# EAGLE design Cap Piano - PCB (EAGLE 9.6.2)
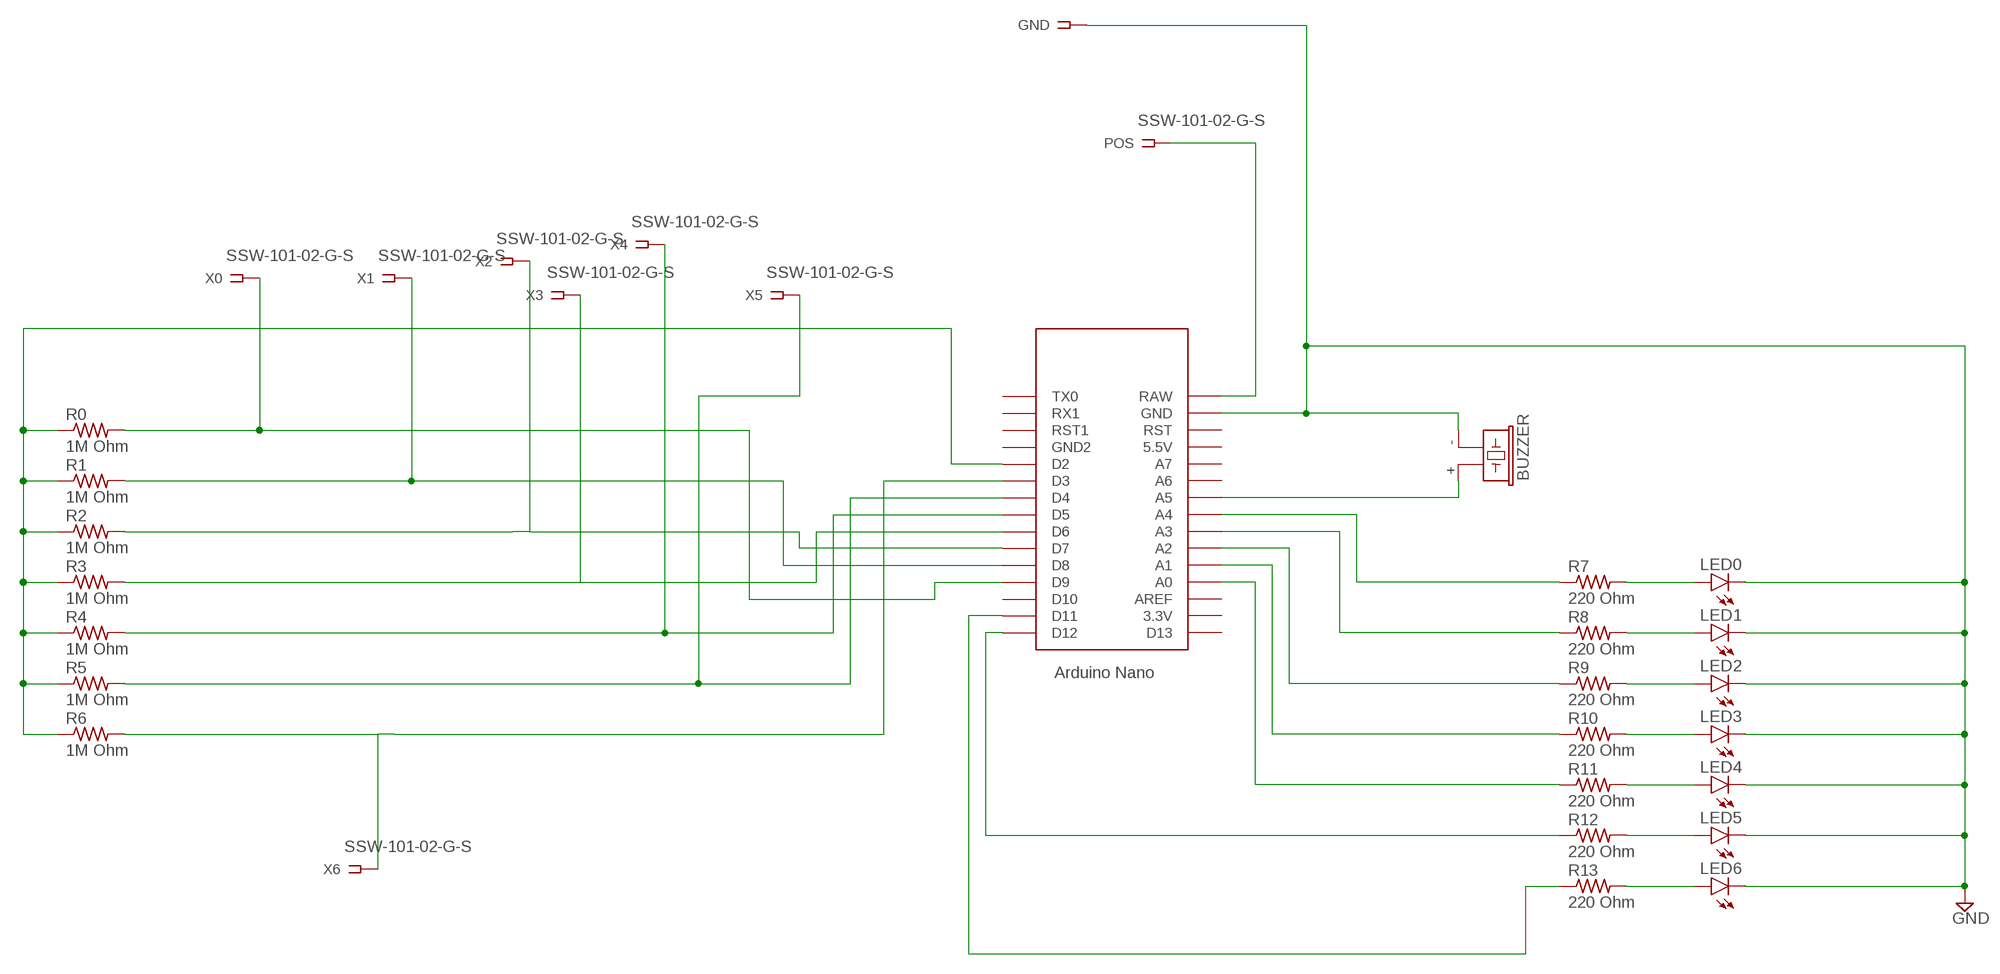
[diagram p0: schematic, sheet 1]

## Parts
BUZZER  F/CM12P  [F/CM12P]
GND  SSW-101-02-G-S  [SSW-101-02-G-S]
LED0  LED5MM  [LED5MM]
LED1  LED5MM  [LED5MM]
LED2  LED5MM  [LED5MM]
LED3  LED5MM  [LED5MM]
LED4  LED5MM  [LED5MM]
LED5  LED5MM  [LED5MM]
LED6  LED5MM  [LED5MM]
POS  SSW-101-02-G-S  [SSW-101-02-G-S]
R0  1M Ohm  R-US_0207/12  [0207/12]
R1  1M Ohm  R-US_0207/12  [0207/12]
R2  1M Ohm  R-US_0207/12  [0207/12]
R3  1M Ohm  R-US_0207/12  [0207/12]
R4  1M Ohm  R-US_0207/12  [0207/12]
R5  1M Ohm  R-US_0207/12  [0207/12]
R6  1M Ohm  R-US_0207/12  [0207/12]
R7  220 Ohm  R-US_0207/12  [0207/12]
R8  220 Ohm  R-US_0207/12  [0207/12]
R9  220 Ohm  R-US_0207/12  [0207/12]
R10  220 Ohm  R-US_0207/12  [0207/12]
R11  220 Ohm  R-US_0207/12  [0207/12]
R12  220 Ohm  R-US_0207/12  [0207/12]
R13  220 Ohm  R-US_0207/12  [0207/12]
U$1  NANO  [NANO]
X0  SSW-101-02-G-S  [SSW-101-02-G-S]
X1  SSW-101-02-G-S  [SSW-101-02-G-S]
X2  SSW-101-02-G-S  [SSW-101-02-G-S]
X3  SSW-101-02-G-S  [SSW-101-02-G-S]
X4  SSW-101-02-G-S  [SSW-101-02-G-S]
X5  SSW-101-02-G-S  [SSW-101-02-G-S]
X6  SSW-101-02-G-S  [SSW-101-02-G-S]

## Nets
GND: BUZZER.- GND.1 LED0.K(C) LED1.K(C) LED2.K(C) LED3.K(C) LED4.K(C) LED5.K(C) LED6.K(C) U$1.GND
N$1: POS.1 U$1.RAW
N$2: R5.2 U$1.D4 X5.1
N$3: BUZZER.+ U$1.A5
N$4: R4.2 U$1.D5 X4.1
N$5: R0.1 R1.1 R2.1 R3.1 R4.1 R5.1 R6.1 U$1.D2
N$6: R6.2 U$1.D3 X6.1
N$9: R3.2 U$1.D6 X3.1
N$10: R2.2 U$1.D7 X2.1
N$11: R1.2 U$1.D8 X1.1
N$12: R0.2 U$1.D9 X0.1
N$14: R13.1 U$1.D11
N$15: R12.1 U$1.D12
N$16: R11.1 U$1.A0
N$17: R10.1 U$1.A1
N$18: R9.1 U$1.A2
N$19: R8.1 U$1.A3
N$20: R7.1 U$1.A4
N$22: LED0.A R7.2
N$23: LED1.A R8.2
N$24: LED2.A R9.2
N$25: LED3.A R10.2
N$26: LED4.A R11.2
N$27: LED5.A R12.2
N$28: LED6.A R13.2
Unconnected: U$1.3.3V U$1.5V(5.5V) U$1.A6 U$1.A7 U$1.AREF U$1.D10 U$1.D13 U$1.GND1(GND2) U$1.ICSP1 U$1.ICSP2 U$1.ICSP3 U$1.ICSP4 U$1.ICSP5 U$1.ICSP6 U$1.RST U$1.RST1 U$1.RX1 U$1.TX0

## Library data of the parts
BUZZER = buzzer:F/CM12P: BUZZER Source: Buerklin; OC_FARNELL: unknown; OC_NEWARK: unknown
GND POS X0 X1-X6 = con-samtec:SSW-101-02-G-S: THROUGH-HOLE .025" SQ POST SOCKET Source: Samtec SSW.pdf; MF: Samtec Inc.; MPN: SSW-101-02-G-S; OC_FARNELL: unknown; OC_NEWARK: 11P9336
LED0 LED1-LED6 = led:LED: LED OSRAM: - CHIPLED LG R971, LG N971, LY N971, LG Q971, LY Q971, LO R971, LY R971 LH N974, LH R974 LS Q976, LO Q976, LY Q976 LO Q996 - Hyper CHIPLED LW Q18S LB Q993, LB Q99A, LB R99A - SideLED LS A670, LO A670, LY A670, LG A670, LP A670 LB A673, LV A673, LT A673, LW A673 LH A674 LY A675 LS A676, LA A676, LO A676, LY A676, LW A676 LS A679, LY A679, LG A679 - Hyper Micro SIDELED® LS Y876, LA Y876, LO Y876, LY Y876 LT Y87S - SmartLED LW L88C, LW L88S LB L89C, LB L89S, LG L890 LS L89K, LO L89K, LY L89K LS L896, LA L896, LO L896, LY L896 - TOPLED LS T670, LO T670, LY T670, LG T670, LP T670 LSG T670, LSP T670, LSY T670, LOP T670, LYG T670 LG T671, LOG T671, LSG T671 LB T673, LV T673, LT T673, LW T673 LH T674 LS T676, LA T676, LO T676, LY T676, LB T676, LH T676, LSB T676, LW T676 LB T67C, LV T67C, LT T67C, LS T67K, LO T67K, LY T67K, LW E67C LS E67B, LA E67B, LO E67B, LY E67B, LB E67C, LV E67C, LT E67C LW T67C LS T679, LY T679, LG T679 LS T770, LO T770, LY T770, LG T770, LP T770 LB T773, LV T773, LT T773, LW T773 LH T774 LS E675, LA E675, LY E675, LS T675 LS T776, LA T776, LO T776, LY T776, LB T776 LHGB T686 LT T68C, LB T68C - Hyper Mini TOPLED® LB M676 - Mini TOPLED Santana® LG M470 LS M47K, LO M47K, LY M47K Source: http://www.osram.convergy.de LUXEON: - LUMILED® LXK2-PW12-R00, LXK2-PW12-S00, LXK2-PW14-U00, LXK2-PW14-V00 LXK2-PM12-R00, LXK2-PM12-S00, LXK2-PM14-U00 LXK2-PE12-Q00, LXK2-PE12-R00, LXK2-PE12-S00, LXK2-PE14-T00, LXK2-PE14-U00 LXK2-PB12-K00, LXK2-PB12-L00, LXK2-PB12-M00, LXK2-PB14-N00, LXK2-PB14-P00, LXK2-PB14-Q00 LXK2-PR12-L00, LXK2-PR12-M00, LXK2-PR14-Q00, LXK2-PR14-R00 LXK2-PD12-Q00, LXK2-PD12-R00, LXK2-PD12-S00 LXK2-PH12-R00, LXK2-PH12-S00 LXK2-PL12-P00, LXK2-PL12-Q00, LXK2-PL12-R00 Source: www.luxeon.com KINGBRIGHT: KA-3528ASYC Source: www.kingbright.com
R0 R1-R13 = rcl:R-US_: RESISTOR, American symbol; SPICEPREFIX: R
U$1 = Arduino-clone:NANO: Arduino Nano

## Board
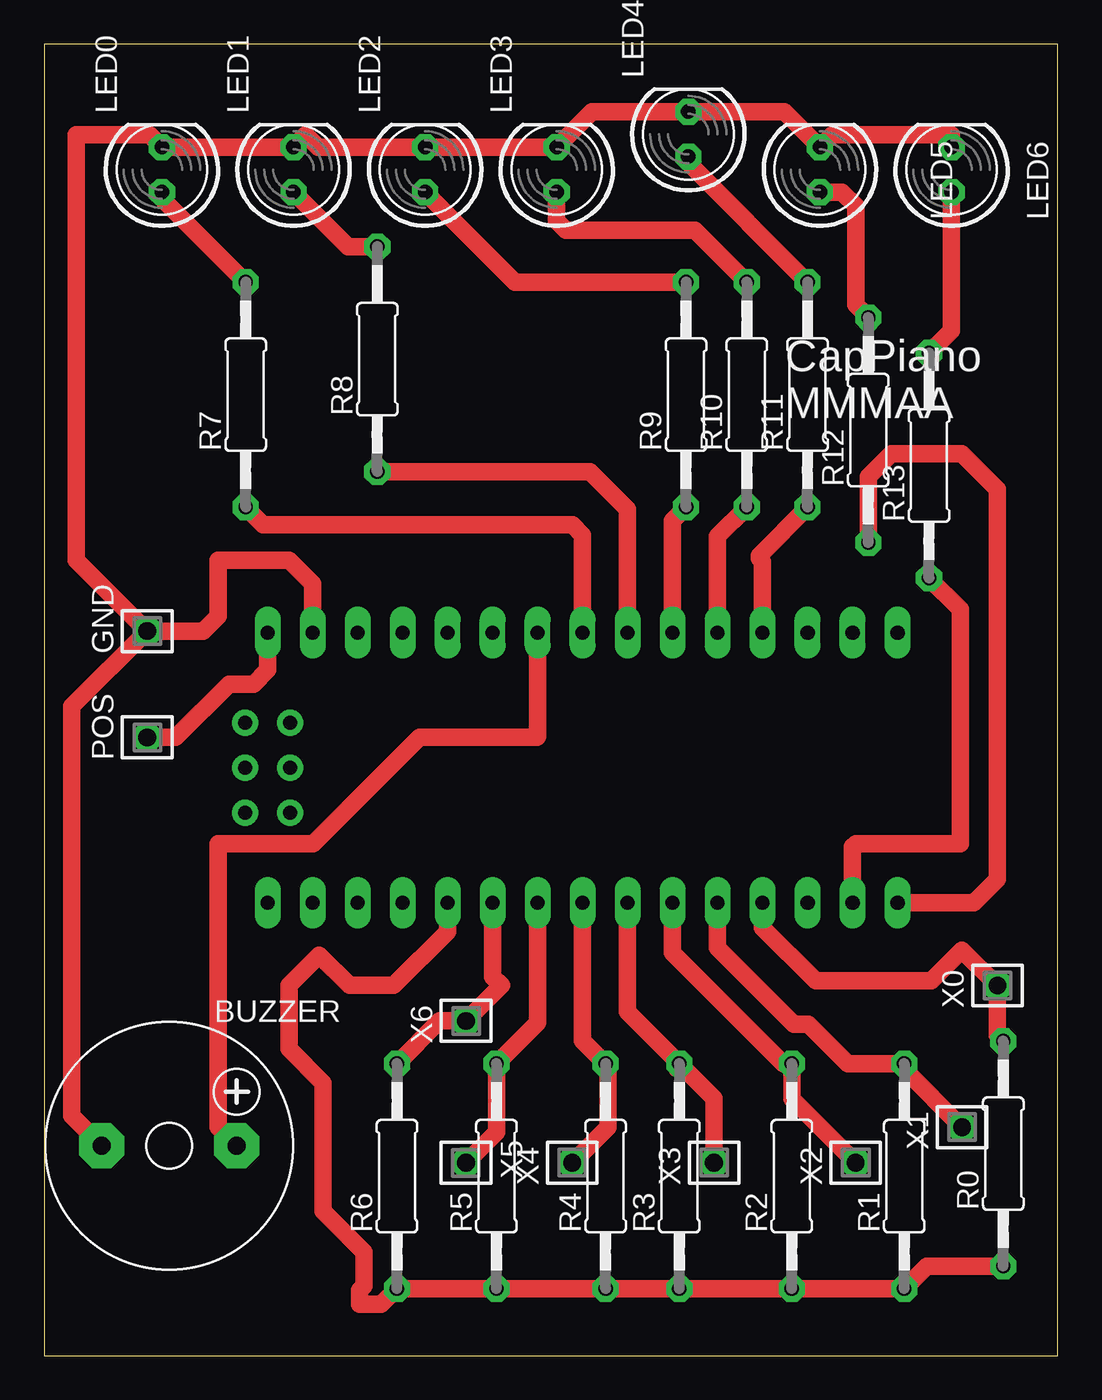
[diagram p1: board, top side]

Size 57.21 x 74 mm. Coordinates in mm from the lower left corner, seen from the top.
Outline: 0,0 57.21,0 57.21,74 0,74 0,0
Copper layers (1*16): Top 0.035mm / dielectric 1.5mm / Bottom 0.035mm
Design rules "default *": minimum track width 1mm, minimum drill 0.35mm, track to track 1mm, track to pad 1mm, pad to pad 1mm, via to via 1mm, smd to smd 1mm, copper to edge 1mm, drill to drill 1mm, minimum pad ring 13mil, minimum via ring 8mil, stop-mask expansion 4mil, vias tented up to drill 0mil, thermal gap 10mil

### Footprints (pad centres in the part's own frame; a part is rotated, then mirrored left to right if it is on the bottom)
F/CM12P = drill 1.016 pad 2.54 octagon: + 3.81,0; - -3.81,0
SSW-101-02-G-S = drill 1 pad 1.5 octagon: 1 0,0
LED5MM = drill 0.813 octagon: A -1.27,0; K 1.27,0
0207/12 = drill 0.813 octagon: 1 -6.35,0; 2 6.35,0
NANO = drill 0.8 long: 3.3V -10.16,24.13; 5V -10.16,-1.27; A0 -10.16,19.05; A1 -10.16,16.51; A2 -10.16,13.97; A3 -10.16,11.43; A4 -10.16,8.89; A5 -10.16,6.35; A6 -10.16,3.81; A7 -10.16,1.27; AREF -10.16,21.59; D2 5.08,1.27; D3 5.08,3.81; D4 5.08,6.35; D5 5.08,8.89; D6 5.08,11.43; D7 5.08,13.97; D8 5.08,16.51; D9 5.08,19.05; D10 5.08,21.59; D11 5.08,24.13; D12 5.08,26.67; D13 -10.16,26.67; GND -10.16,-6.35; GND1 5.08,-1.27; RAW -10.16,-8.89; RST -10.16,-3.81; RST1 5.08,-3.81; RX1 5.08,-6.35; TX0 5.08,-8.89 | drill 0.8: ICSP1 -5.08,-10.16; ICSP2 -5.08,-7.62; ICSP3 -2.54,-10.16; ICSP4 -2.54,-7.62; ICSP5 0,-10.16; ICSP6 0,-7.62

### Placement (x,y rotation side)
BUZZER  7.05,11.85 0 top
GND  5.81,40.89 0 top
LED0  6.64,66.93 90 top
LED1  14.07,66.93 90 top
LED2  21.5,66.93 90 top
LED3  28.93,66.93 90 top
LED4  36.36,68.93 90 top
LED5  43.79,66.93 90 top
LED6  51.22,66.93 90 top
POS  5.81,34.89 0 top
R0  54.14,11.4 90 top
R1  48.55,10.13 90 top
R2  42.2,10.13 90 top
R3  35.85,10.13 90 top
R4  31.69,10.13 90 top
R5  25.53,10.13 90 top
R6  19.91,10.13 90 top
R7  11.37,54.23 90 top
R8  18.8,56.23 90 top
R9  36.23,54.23 90 top
R10  39.66,54.23 90 top
R11  43.09,54.23 90 top
R12  46.52,52.23 90 top
R13  49.95,50.23 90 top
U$1  21.5,30.64 270 top
X0  53.81,20.89 0 top
X1  51.81,12.89 0 top
X2  45.81,10.89 0 top
X3  37.81,10.89 0 top
X4  29.81,10.89 0 top
X5  23.81,10.89 180 top
X6  23.81,18.89 0 top

### Tracks (layer width: path | path; a pad name or v marks a point on that pad's centre or on a via)
GND
  Top 1: BUZZER.- 1.56,13.53 1.56,36.64 GND.1 | GND.1 8.98,40.89 9.81,41.72 9.81,44.89 13.81,44.89 15.15,43.55 U$1.GND | GND.1 1.81,44.89 1.81,68.89 5.95,68.89 LED0.K LED1.K 14.76,68.89 15.45,68.2 LED2.K LED3.K 30.93,70.2 LED4.K 41.79,70.2 LED5.K 44.48,68.89 51.22,68.89 LED6.K
N$1
  Top 1: U$1.RAW 12.61,38.7 11.81,37.9 10.44,37.9 7.43,34.89 POS.1
N$2
  Top 1: U$1.D4 27.85,18.8 R5.2 25.53,12.61 X5.1
N$3
  Top 1: BUZZER.+ 9.81,12.9 9.81,28.89 15.18,28.89 21.18,34.89 27.81,34.89 27.85,34.93 U$1.A5
N$4
  Top 1: U$1.D5 30.39,17.78 R4.2 31.81,16.36 31.81,12.89 X4.1
N$5
  Top 1: R0.1 49.82,5.05 R1.1 R2.1 R3.1 R4.1 R5.1 R6.1 19.02,2.89 17.81,2.89 17.81,3.7 18.06,3.96 18.06,5.82 15.75,8.14 15.75,15.38 13.81,17.31 13.81,20.89 15.52,22.6 17.23,20.89 19.73,20.89 22.77,23.93 U$1.D2
N$6
  Top 1: R6.2 22.32,18.89 X6.1 25.81,20.89 25.31,21.39 U$1.D3
N$9
  Top 1: R3.2 35.72,16.18 35.81,16.27 | R3.2 37.81,14.52 X3.1 | R3.2 32.93,19.4 U$1.D6
N$10
  Top 1: X2.1 42.2,14.5 R2.2 41.72,16.48 35.47,22.73 U$1.D7
N$11
  Top 1: U$1.D8 38.01,23.02 42.31,18.72 43.13,18.72 45.36,16.48 R1.2 48.55,16.15 X1.1
N$12
  Top 1: U$1.D9 40.55,24.15 43.56,21.14 44.84,21.14 44.87,21.17 50.09,21.17 51.81,22.89 X0.1 53.81,18.08 R0.2
N$14
  Top 1: U$1.D11 45.63,28.71 45.81,28.89 51.71,28.89 51.71,42.12 R13.1
N$15
  Top 1: R12.1 46.52,49.6 47.81,50.89 51.81,50.89 53.81,48.89 53.81,26.89 52.48,25.56 U$1.D12
N$16
  Top 1: R11.1 40.36,45.15 40.36,44.98 40.55,44.8 U$1.A0
N$17
  Top 1: R10.1 38.01,46.23 U$1.A1
N$18
  Top 1: R9.1 35.47,47.12 U$1.A2
N$19
  Top 1: 32.93,41.96 U$1.A3 32.93,47.77 30.82,49.88 R8.1
N$20
  Top 1: R7.1 12.36,46.89 29.81,46.89 30.39,46.31 U$1.A4
N$22
  Top 1: R7.2 6.64,65.31 LED0.A
N$23
  Top 1: R8.2 17.15,62.58 LED1.A
N$24
  Top 1: R9.2 26.58,60.58 LED2.A
N$25
  Top 1: R10.2 36.74,63.5 29.47,63.5 28.93,64.03 LED3.A
N$26
  Top 1: R11.2 36.36,67.31 LED4.A
N$27
  Top 1: R12.2 45.81,59.29 45.81,64.89 45.04,65.66 LED5.A
N$28
  Top 1: LED6.A 51.22,57.85 R13.2

### Text on the board
tPlace: CapPiano / MMMAA